# EAGLE schematic ds1804 (EAGLE 6.4)
PyRadio
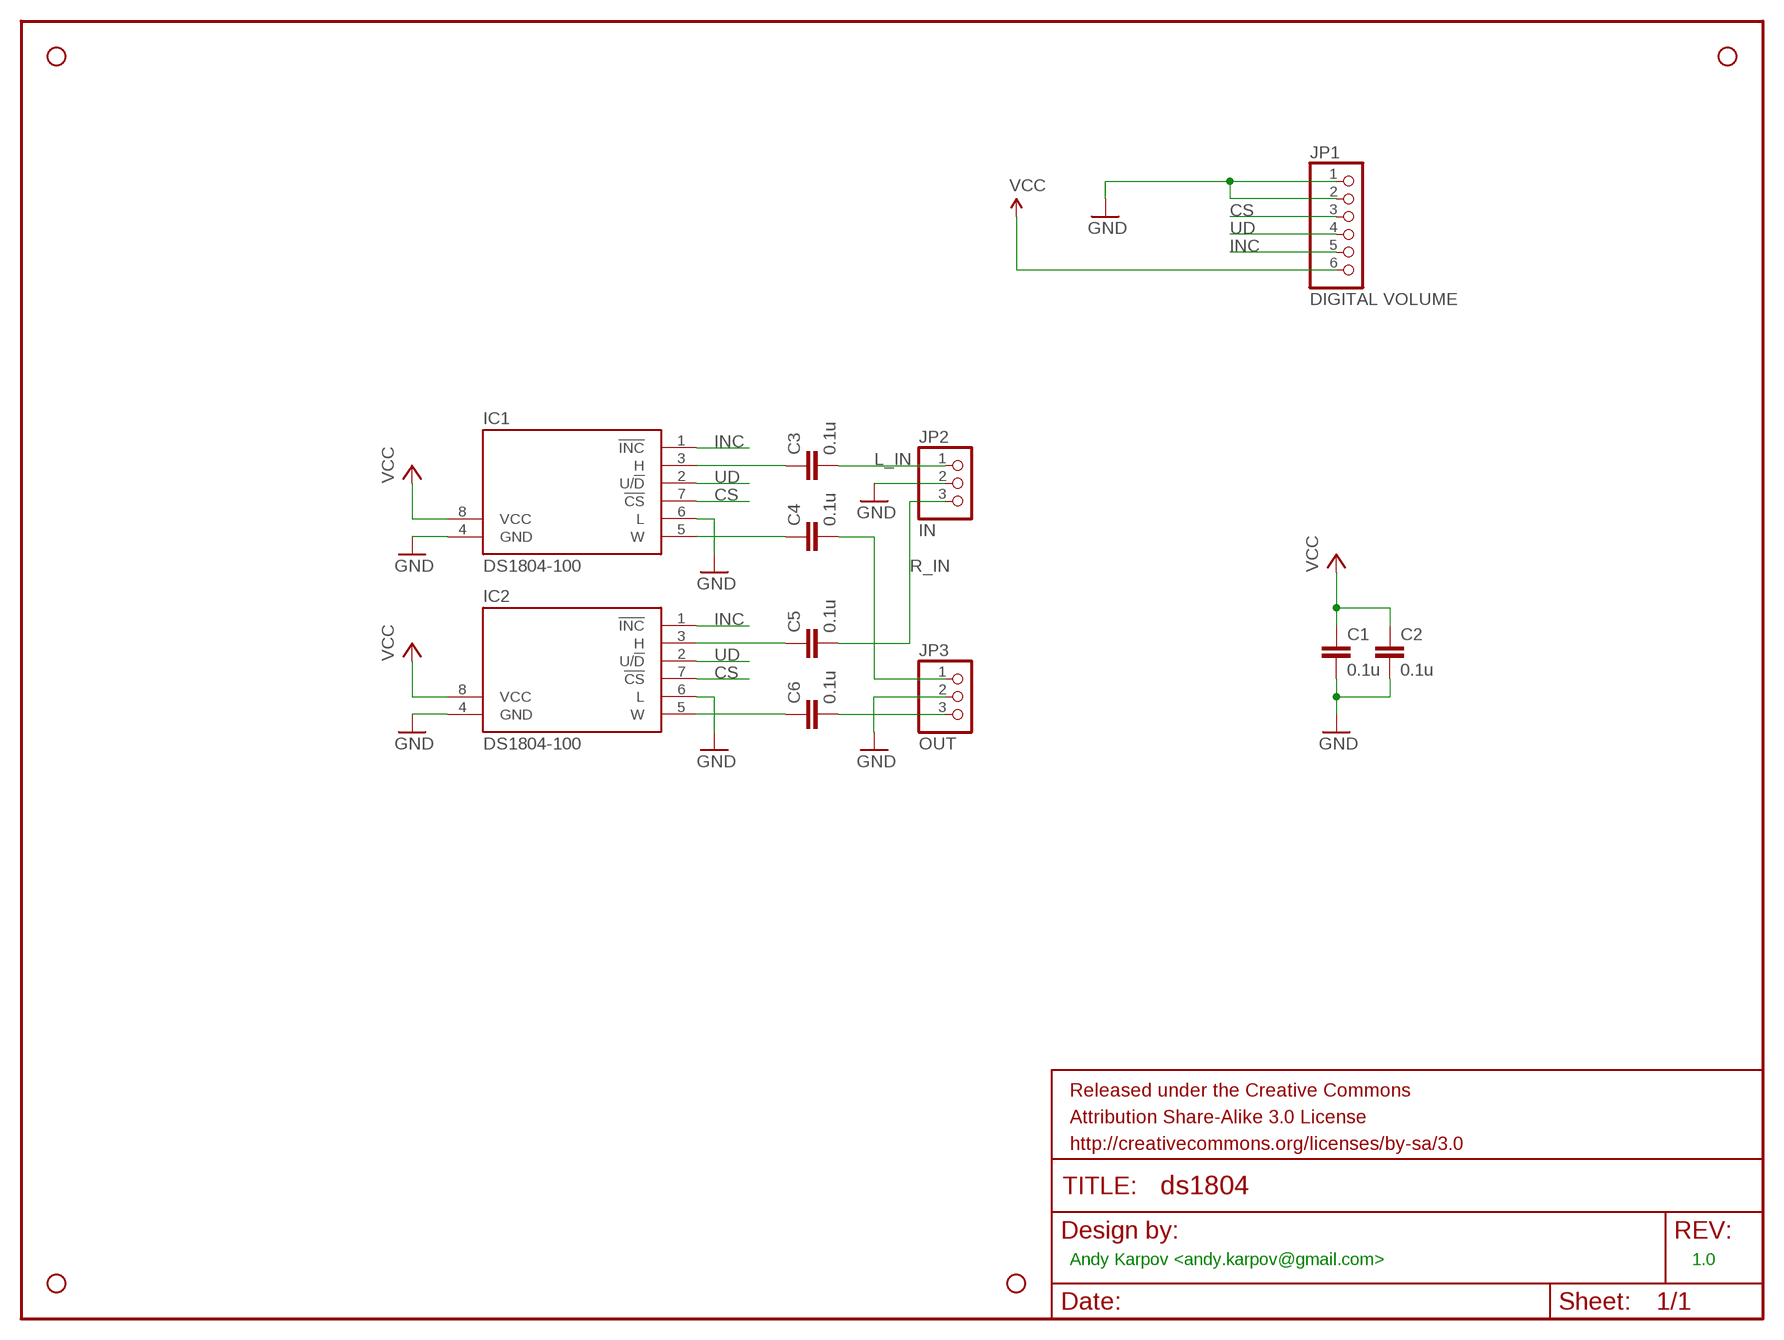
[diagram p0: schematic, sheet 1]

## Parts
C1  0.1u  C-EU025-025X050  [C025-025X050]
C2  0.1u  C-EU025-025X050  [C025-025X050]
C3  0.1u  C-EU025-025X050  [C025-025X050]
C4  0.1u  C-EU025-025X050  [C025-025X050]
C5  0.1u  C-EU025-025X050  [C025-025X050]
C6  0.1u  C-EU025-025X050  [C025-025X050]
FRAME1  FRAME-LETTER  [CREATIVE_COMMONS]
IC1  DS1804-100  DS1804P  [DIL08]
IC2  DS1804-100  DS1804P  [DIL08]
JP1  DIGITAL VOLUME  PINHD-1X6  [1X06]
JP2  IN  PINHD-1X3  [1X03]
JP3  OUT  PINHD-1X3  [1X03]
STANDOFF1  STAND-OFF  [STAND-OFF]
STANDOFF2  STAND-OFF  [STAND-OFF]
STANDOFF3  STAND-OFF  [STAND-OFF]
STANDOFF4  STAND-OFF  [STAND-OFF]

## Nets
CS: IC1.7(!CS) IC2.7(!CS) JP1.3
GND: C1.2 C2.2 IC1.4(GND) IC1.6(L) IC2.4(GND) IC2.6(L) JP1.1 JP1.2 JP2.2 JP3.2
INC: IC1.1(!INC) IC2.1(!INC) JP1.5
L_IN: C3.2 JP2.1
L_OUT: C4.2 JP3.1
N$5: C5.1 IC2.3(H)
N$6: C6.1 IC2.5(W)
N$7: C3.1 IC1.3(H)
N$9: C4.1 IC1.5(W)
R_IN: C5.2 JP2.3
R_OUT: C6.2 JP3.3
UD: IC1.2(U/!D) IC2.2(U/!D) JP1.4
VCC: C1.1 C2.1 IC1.8(VCC) IC2.8(VCC) JP1.6

## Notes on the sheet
- Andy Karpov <andy.karpov@gmail.com> | 1.0

## Library data of the parts
C1 C2 = rcl:C-EU: CAPACITOR, European symbol
C3-C6 = resistor:C-EU: CAPACITOR, European symbol
FRAME1 = SparkFun-Aesthetics:FRAME-LETTER: Schematic Frame Standard 8.5x11 US Letter frame
IC1 IC2 = ds1804:DS1804: MICROCONTROLLER 1 Kbytes ROM; OC_FARNELL: unknown; OC_NEWARK: unknown
JP1 = pinhead:PINHD-1X6: PIN HEADER
JP2 JP3 = pinhead:PINHD-1X3: PIN HEADER
STANDOFF1-STANDOFF4 = SparkFun-Electromechanical:STAND-OFF: #4 Stand Off This is the mechanical footprint for a #4 phillips button head screw. Use the keepout ring to avoid running the screw head into surrounding components. SKU : PRT-00447